# EAGLE design Mini Arcade (EAGLE 9.6.2)
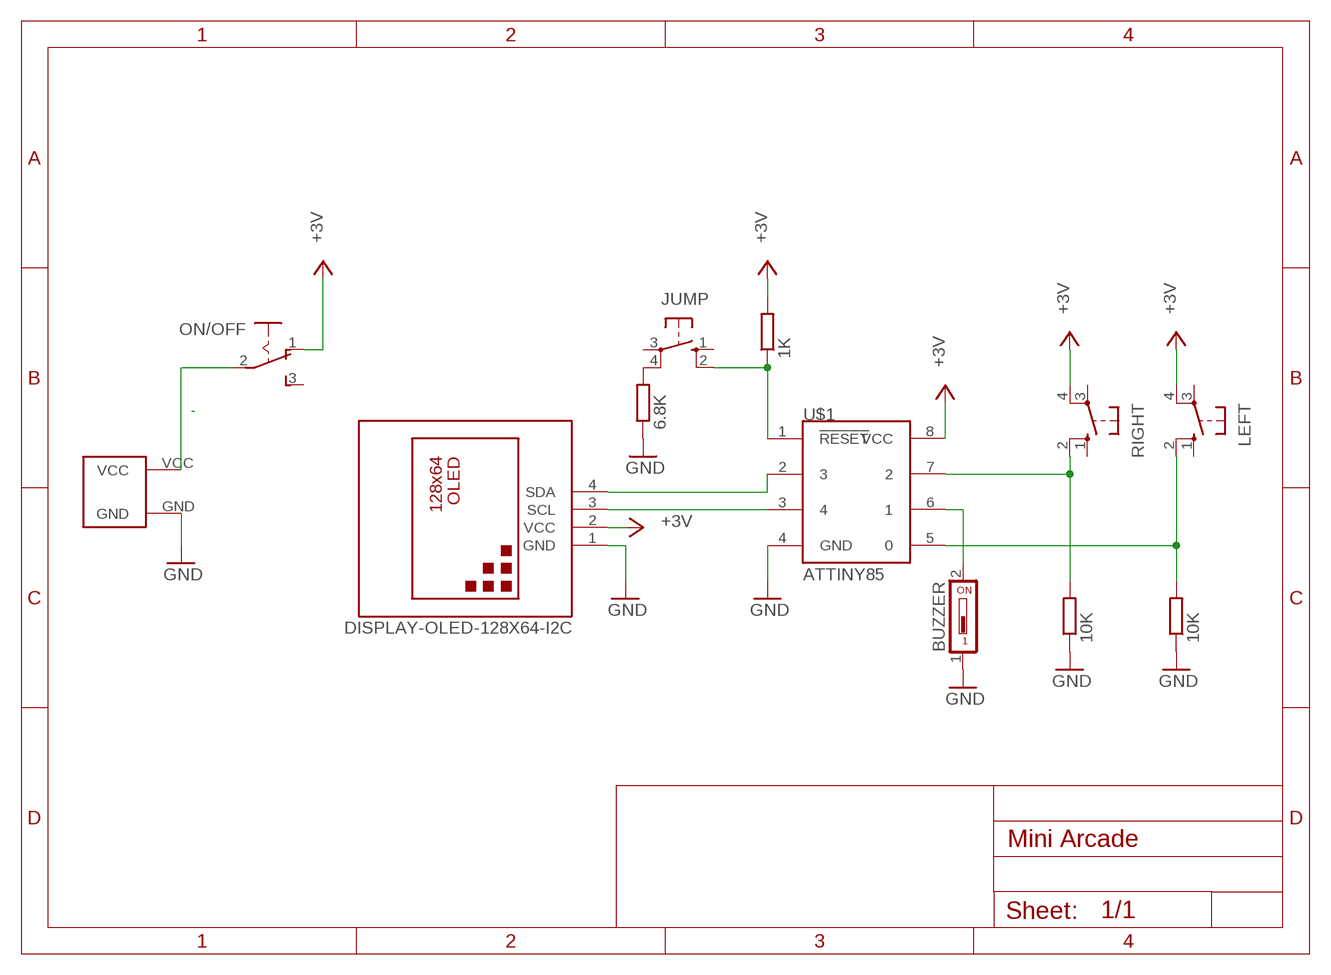
[diagram p0: schematic, sheet 1]

## Parts
BUZZER  DS01  [DS-01]
JUMP  10-XX  [B3F-10XX]
LEFT  10-XX  [B3F-10XX]
ON/OFF  M251  [M251]
R1  10K  R-EU_0207/10  [0207/10]
R2  10K  R-EU_0207/10  [0207/10]
R3  1K  R-EU_0207/10  [0207/10]
R4  6.8K  R-EU_0207/10  [0207/10]
RIGHT  10-XX  [B3F-10XX]
U$1  ATTINY85  [8P3]
U$2  DISPLAY-OLED-128X64-I2C  [DISPLAY-OLED-128X64-I2C]
U$5  CR2032  [CR2032-20MM]

## Nets
+3V3: LEFT.4(P1) ON/OFF.1(O) R3.2 RIGHT.4(P1) U$1.8(VCC) U$2.2(VCC) ; supply symbol labelled +3V
GND: BUZZER.1 R1.1 R2.1 R4.1 U$1.4(GND) U$2.1(GND) U$5.GND
N$1: U$1.3 U$2.3(SCL)
N$2: U$1.2 U$2.4(SDA)
N$3: R1.2 RIGHT.2(S1) U$1.7
N$4: LEFT.2(S1) R2.2 U$1.5
N$5: BUZZER.2 U$1.6
N$6: JUMP.4(P1) R4.2
N$7: JUMP.2(S1) R3.1 U$1.1(!RESET)
N$10: ON/OFF.2(P) U$5.VCC
Unconnected: JUMP.1(S) JUMP.3(P) LEFT.1(S) LEFT.3(P) ON/OFF.3(S) RIGHT.1(S) RIGHT.3(P)

## Library data of the parts
BUZZER = buzzer:DS01: DIL/CODE SWITCH; OC_FARNELL: unknown; OC_NEWARK: unknown
JUMP LEFT RIGHT = switch-omron:10-XX: OMRON SWITCH; MPN: B3F-1000; OC_FARNELL: 176432; OC_NEWARK: 36M3542
ON/OFF = switches M Dunn:M251: SLIDING SWITCH Mors, distributor Buerklin, 11G702
R1-R4 = rcl:R-EU_: RESISTOR, European symbol; SPICEPREFIX: R
U$1 = attiny85:ATTINY85
U$2 = diy-modules:DISPLAY-OLED-128X64-I2C: 128x64 Dot Matrix OLED Module based on SSD1306 chip Variant with I2C interface More details available here: http://www.instructables.com/id/Monochrome-096-i2c-OLED-display-with-arduino-SSD13/ SSD1306 datasheet: https://cdn-shop.adafruit.com/datasheets/SSD1306.pdf Click here to find device on ebay.com <http://www.ebay.com/sch/oled+display+128x64+iic> Note: There are two variants: I2C and SPI. Search for the proper version.
U$5 = cr2032:CR2032

## Board
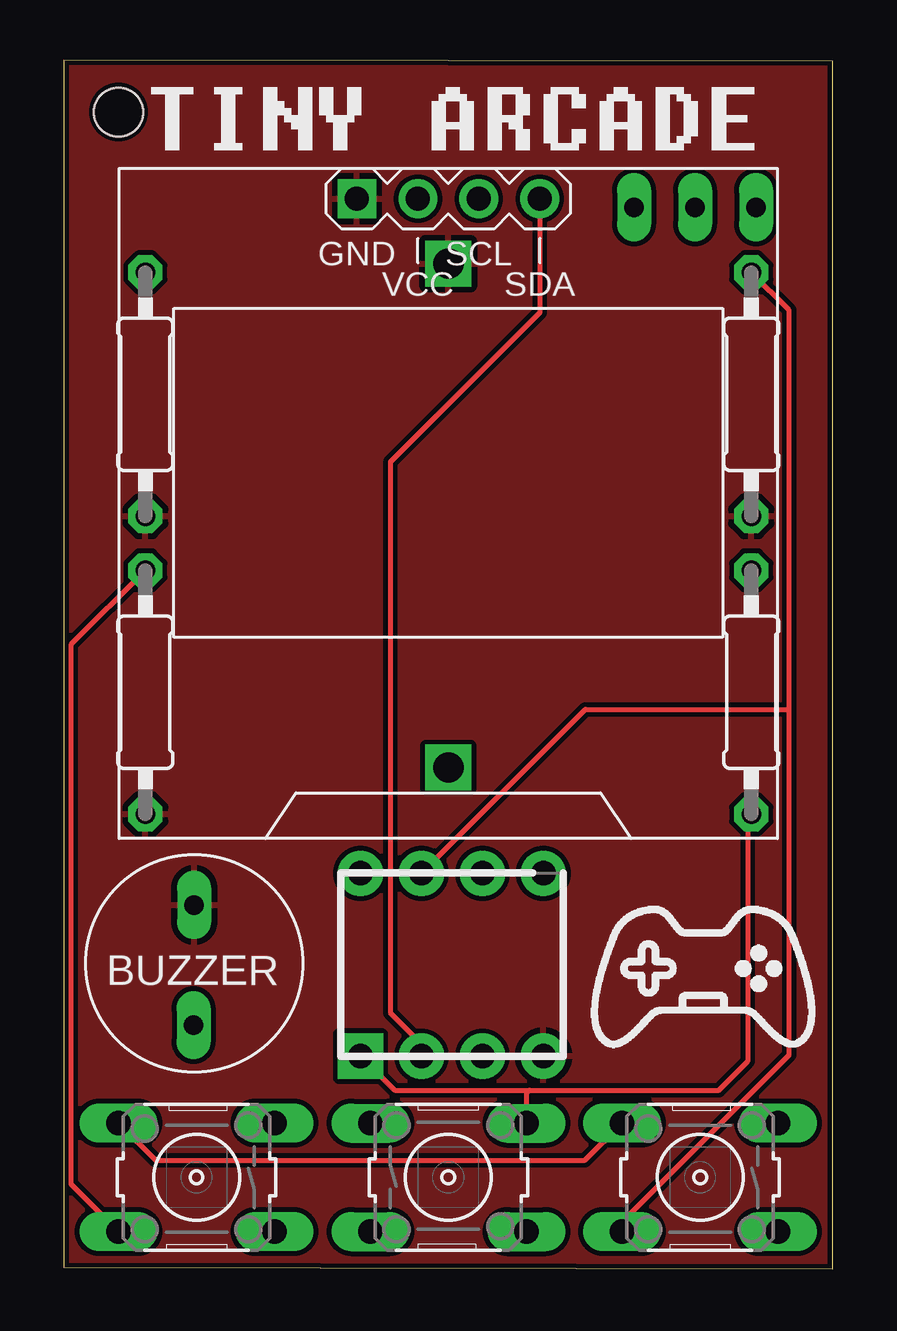
[diagram p1: board, top side]
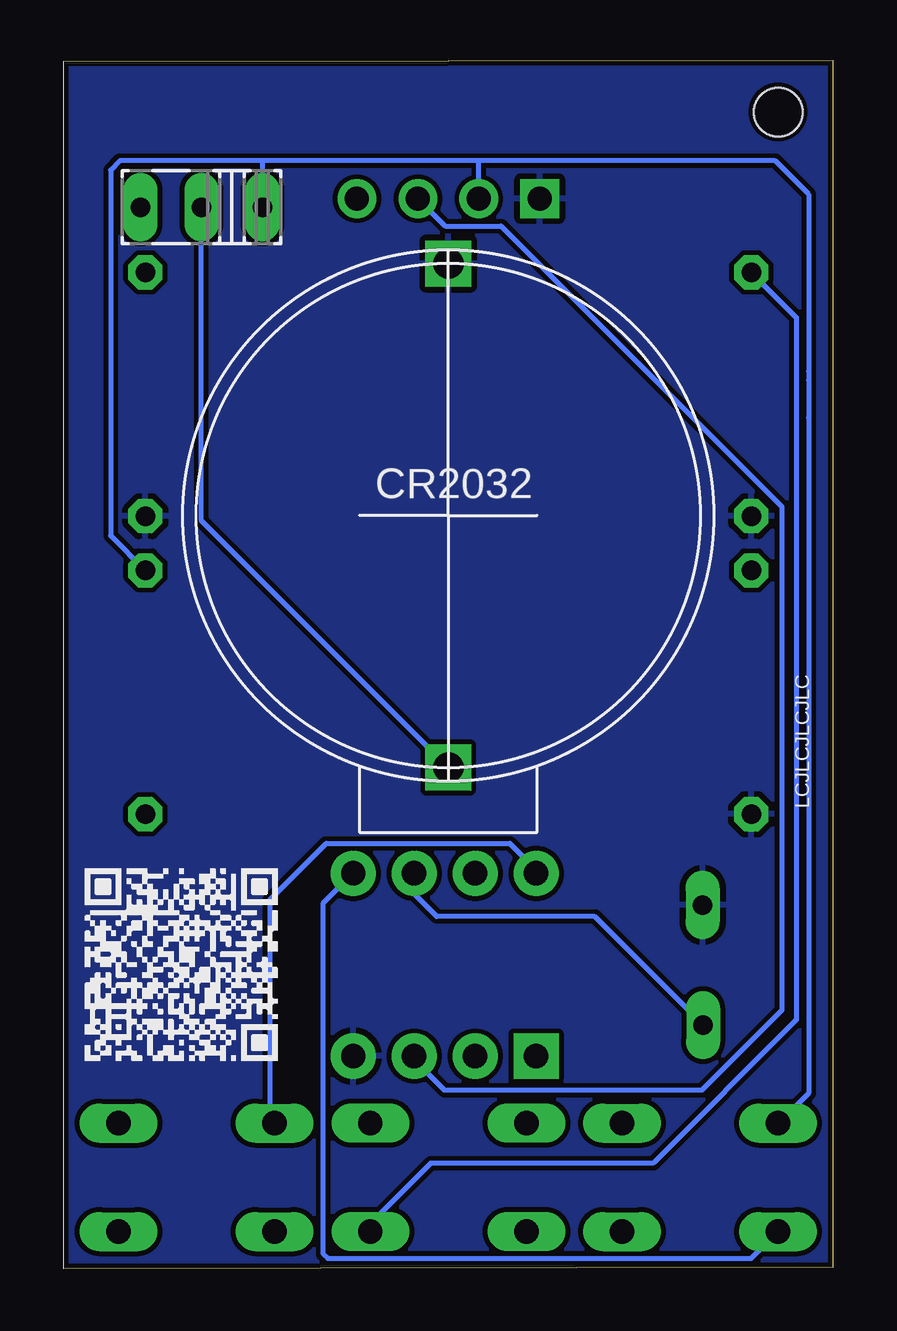
[diagram p2: board, bottom side, seen from below]

Size 32.05 x 50.38 mm. Coordinates in mm from the lower left corner, seen from the top.
Outline: 0,0.05 32.05,0 32.05,50.33 0,50.38 0,0.05
Copper layers (1*16): Top 0.035mm / dielectric 1.5mm / Bottom 0.035mm
Design rules "SparkFun": minimum track width 8mil, minimum drill 20mil, track to track 8mil, track to pad 8mil, pad to pad 8mil, via to via 8mil, smd to smd 8mil, copper to edge 8mil, drill to drill 8mil, minimum pad ring 12mil, minimum via ring 10mil, stop-mask expansion 4mil, vias tented up to drill 20mil, thermal gap 10mil
Holes 2.03 mm at 2.29,48.21

### Footprints (pad centres in the part's own frame; a part is rotated, then mirrored left to right if it is on the bottom)
DS-01 = drill 0.813 long: 1 0,-2.438; 2 0.025,2.565
B3F-10XX = drill 1.016 long: 1 -3.251,2.261; 2 3.251,2.261; 3 -3.251,-2.261; 4 3.251,-2.261
M251 = drill 0.813 long: 1 -2.54,0; 2 0,0; 3 2.54,0
0207/10 = drill 0.813 octagon: 1 -5.08,0; 2 5.08,0
8P3 = drill 1.016 pad 1.88 square: 1 -3.81,3.81 | drill 1.016 pad 1.88: 2 -3.81,1.27; 3 -3.81,-1.27; 4 -3.81,-3.81; 5 3.81,-3.81; 6 3.81,-1.27; 7 3.81,1.27; 8 3.81,3.81
DISPLAY-OLED-128X64-I2C = drill 1 square: 1 -3.81,12.7 | drill 1: 2 -1.27,12.7; 3 1.27,12.7; 4 3.81,12.7
CR2032-20MM = drill 1.27 square: GND 0,10.5; VCC 0,-10.5

### Placement (x,y rotation side)
BUZZER  5.44,12.73 180 top
JUMP  16.03,3.81 0 top
LEFT  5.54,3.81 180 top
ON/OFF  26.31,44.25 180 bottom
R1  28.65,36.45 90 top
R2  3.4,24.03 90 top
R3  28.65,24.03 90 top
R4  3.4,36.45 90 top
RIGHT  26.52,3.81 180 top
U$1  16.18,12.67 90 top
U$2  16.03,31.9 0 top
U$5  16.03,31.39 0 bottom

### Tracks (layer width: path | path; a pad name or v marks a point on that pad's centre or on a via)
+3V3
  Top 0.203: LEFT.4 3.84,4.52 21.72,4.52 RIGHT.4
  Bottom 0.203: RIGHT.4 23.47,6.27 23.47,15.37 21.11,17.73 13.46,17.73 12.37,16.64 U$1.8 | LEFT.4 2.26,6.07 1.02,7.32 1.02,35.46 1.02,37.03 1.02,37.41 1.02,44.78 2.41,46.18 14.76,46.18 | U$2.2 14.76,46.18 | 14.76,46.18 23.77,46.18 | 23.77,46.18 ON/OFF.1 | 23.77,46.18 29.72,46.18 30.1,45.8 30.1,30.56 R3.2
GND
  pour Top: 0,0.05 0,50.24 32.05,50.24 32.05,0.05
  pour Bottom: 0,0.05 0,50.24 32.05,50.24 32.05,0.05
N$1
  Bottom 0.203: U$2.3 16.15,43.46 13.83,43.46 2.13,31.76 2.13,10.77 5.46,7.44 16.18,7.44 17.45,8.71 U$1.3
N$2
  Top 0.203: U$2.4 19.84,39.85 13.61,33.63 13.61,10.67 14.91,9.37 U$1.2
N$3
  Top 0.203: U$1.7 21.74,23.32 30.23,23.32 | 30.23,23.32 30.23,39.95 R1.2 | RIGHT.2 23.27,1.96 30.23,8.92 30.23,23.32
N$4
  Top 0.203: R2.2 0.3,26.01 0.3,3.53 LEFT.2
  Bottom 0.203: LEFT.2 3.4,0.43 21.06,0.43 21.23,0.61 21.23,15.24 U$1.5
N$5
  Bottom 0.203: BUZZER.2 9.93,14.68 16.51,14.68 17.45,15.62 U$1.6
N$6
  Bottom 0.203: R4.2 1.52,39.65 1.52,10.36 7.49,4.39 16.76,4.39 19.28,1.88 JUMP.4
N$7
  Top 0.203: 19.41,7.44 19.28,7.32 JUMP.2 | 19.41,7.44 13.79,7.44 U$1.1 | 19.41,7.44 27.3,7.44 28.5,8.64 28.5,18.8 R3.1
N$10
  Bottom 0.203: U$5.VCC 26.31,31.18 ON/OFF.2

### Text on the board
bPlace: LCJLCJLCJLC